# Altium schematic sheet Power.SchDoc
size A
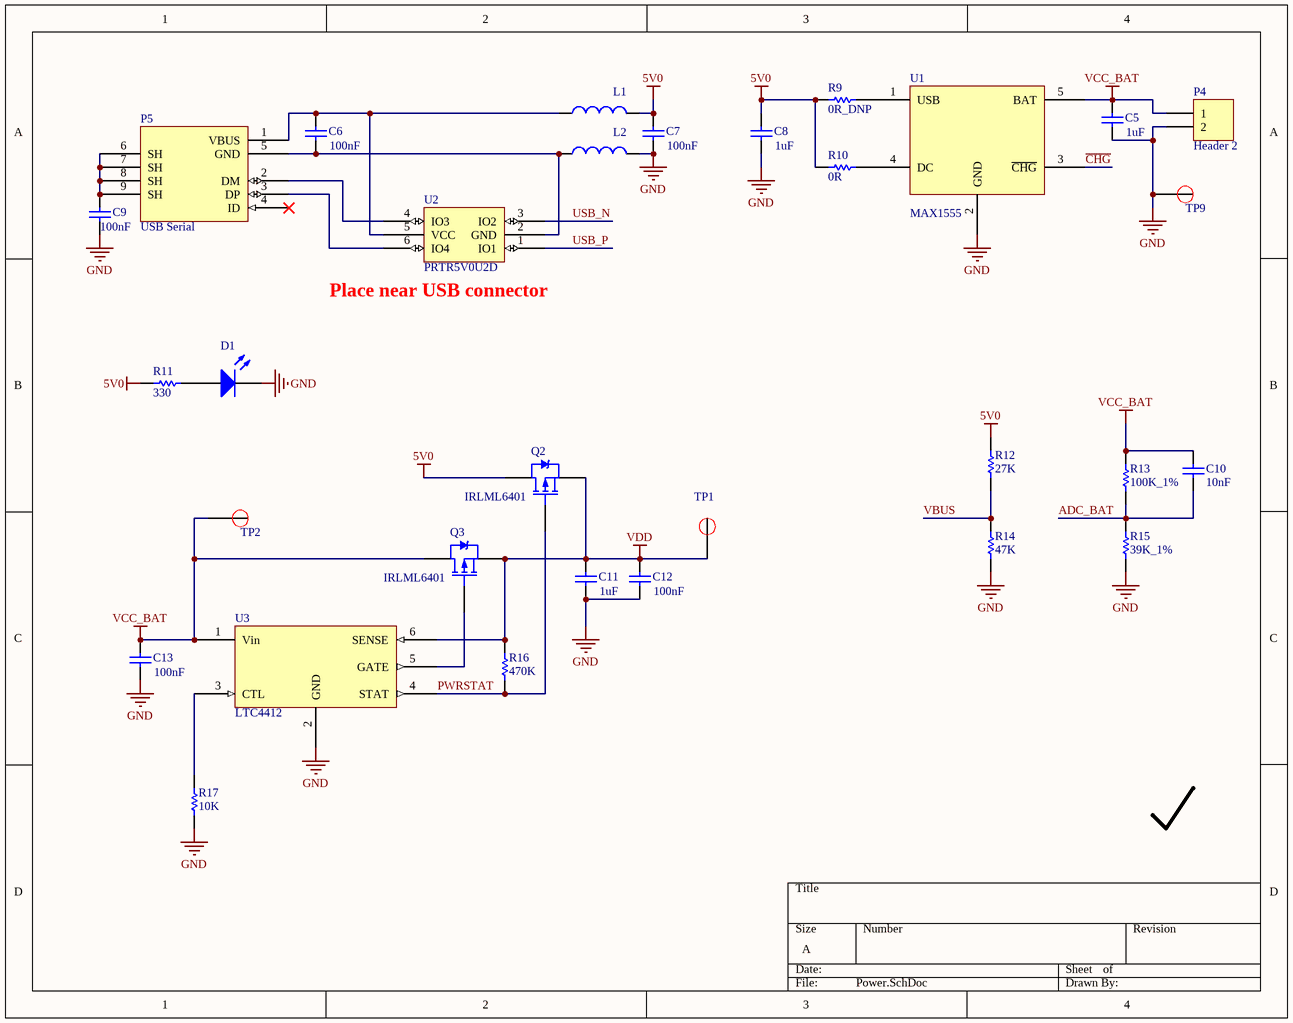
[diagram p0: Power.SchDoc]

## Parts
C5  value 1uF  [0603PKG]  (hidden comment: Cap)
C6  value 100nF  [C0805]  (hidden comment: Cap)
C7  value 100nF  [C0805]  (hidden comment: Cap)
C8  value 1uF  [0603PKG]  (hidden comment: Cap)
C9  value 100nF  [C0805]  (hidden comment: Cap)
C10  value 10nF  [0603PKG]  (hidden comment: Cap Semi)
C11  value 1uF  [0603PKG]  (hidden comment: Cap)
C12  value 100nF  [0603PKG]  (hidden comment: Cap)
C13  value 100nF  [0603PKG]  (hidden comment: Cap)
D1  LED0  [C0805]  (value not drawn)
L1  Ferrite Bead  [C0805]  (value not drawn)
L2  Ferrite Bead  [C0805]  (value not drawn)
P4  Header 2  [XH_2Pin_RA]
P5  USB Serial  [Mini USB]
Q2  IRLML6401  [SOT23]
Q3  IRLML6401  [SOT23]
R9  value 0R_DNP  [0603PKG]  (hidden comment: Res Semi)
R10  value 0R  [0603PKG]  (hidden comment: Res Semi)
R11  value 330  [0603PKG]  (hidden comment: Res Semi)
R12  value 27K  [0603PKG]  (hidden comment: Res Semi)
R13  value 100K_1%  [0603PKG]  (hidden comment: Res Semi)
R14  value 47K  [0603PKG]  (hidden comment: Res Semi)
R15  value 39K_1%  [0603PKG]  (hidden comment: Res Semi)
R16  value 470K  [0603PKG]  (hidden comment: Res Semi)
R17  value 10K  [0603PKG]  (hidden comment: Res Semi)
TP1  TP  [TP_15]  (value not drawn)
TP2  TP  [TP_15]  (value not drawn)
TP9  TP  [TP_15]  (value not drawn)
U1  MAX1555  [SOT23-5]
U2  PRTR5V0U2D  [SOT457]
U3  LTC4412  [SOT23-6]

## Nets
5V0: C7.2 C8.2 L1.2 Q2.3(D) R9.1 R10.1 R11.2 R12.2
GND: C5.1 C7.1 C8.1 C9.1 C11.1 C12.1 C13.1 D1.2(K) L2.2 P4.2 R14.1 R15.1 R17.1 TP9.1 U1.2(GND) U3.2(GND)
VCC_BAT: C5.2 C10.1 C13.2 P4.1 Q3.3(D) R13.2 TP2.1 U1.5(BAT) U3.1(Vin)
VDD: C11.2 C12.2 Q2.2(S) Q3.2(S) R16.2 TP1.1 U3.6(SENSE)
ADC_BAT: C10.2 R13.1 R15.2
~{CHG}: U1.3(~{CHG})
PWRSTAT: Q2.1(G) R16.1 U3.4(STAT)
USB_N: U2.3(IO2)
USB_P: U2.1(IO1)
VBUS: R12.1 R14.2
NetC6_1: C6.1 L2.1 P5.5(GND) U2.2(GND)
NetC6_2: C6.2 L1.1 P5.1(VBUS) U2.5(VCC)
NetC9_2: C9.2 P5.6(SH) P5.7(SH) P5.8(SH) P5.9(SH)
NetD1_1: D1.1(A) R11.1
NetP5_2: P5.2(DM) U2.4(IO3)
NetP5_3: P5.3(DP) U2.6(IO4)
NetQ3_1: Q3.1(G) U3.5(GATE)
NetR9_2: R9.2 U1.1(USB)
NetR10_2: R10.2 U1.4(DC)
NetR17_2: R17.2 U3.3(CTL)

Not connected (* = marked no-connect by the designer): P5 4(ID)*

## Notes on the sheet
- (near U2) Place near USB connector

## Library data of the parts
C5-C9 C11-C13 = Cap: Capacitor; Published: 8-Jun-2000; LatestRevisionDate: 17-Jul-2002; LatestRevisionNote: Re-released for DXP Platform.; PackageReference: RAD-0.3; Publisher: Altium Limited; PackageDescription: Radial Cap, Thru-Hole; 2 Leads; 0.3 in Pin Spacing
C10 = Cap Semi: Capacitor (Semiconductor SIM Model); Published: 8-Jun-2000; LatestRevisionDate: 29-May-2009; LatestRevisionNote: IPC-7351 Footprint Added.; PackageReference: C1206; Publisher: Altium Limited; PackageDescription: Chip Capacitor
D1 = LED0: Typical INFRARED GaAs LED; Published: 8-Jun-2000; LatestRevisionDate: 08-Jul-2005; LatestRevisionNote: Mech Layer 1 removed.; PackageReference: LED-0; Publisher: Altium Limited; PackageDescription: LED; 2 Leads
L1 L2 = Inductor: Code_IEC: 1005; Value: 10mH; Published: 8-Jun-2000; LatestRevisionDate: 29-May-2009; LatestRevisionNote: IPC-7351 Footprint Added.; PackageReference: 0402-A; Publisher: Altium Limited; PackageDescription: Chip Inductor; Code_JEITA: 0402
P4 = Header 2: Header, 2-Pin; LatestRevisionDate: 17-Jul-2002; LatestRevisionNote: Re-released for DXP Platform.; Publisher: Altium Limited
P5 = Mini USB
Q2 Q3 = PMOS-2: P-Channel Power MOSFET; Note: Pin 4 not drawn and electrically connected to Pin 2.; Published: 8-Jun-2000; LatestRevisionDate: 17-Jul-2002; LatestRevisionNote: Re-released for DXP Platform.; DatasheetVersion: PD-9.390D; PackageVersion: Feb-1997; PackageReference: TO-220AB; Publisher: Altium Limited; PackageDescription: TO, Thru-Hole, Vertical, Heatsink Mounted; 3 In-Line Leads; Pitch 2.54 mm; ComponentLink1Description: Manufacturer Link; ComponentLink1URL: http://www.irf.com/
R9-R17 = Res Semi: Semiconductor Resistor; Published: 8-Jun-2000; LatestRevisionDate: 17-Jul-2002; LatestRevisionNote: Re-released for DXP Platform.; PackageReference: AXIAL-0.5; Publisher: Altium Limited; PackageDescription: Axial Device, Thru-Hole; 2 Leads; 0.5 in Pin Spacing
TP1 TP2 TP9 = Test Point
U1 = MAX1555: 1-Cell Li+  Battery Chargers
U2 = PRTR5V0U2D: TVS Zener
U3 = LTC4412: Low Loss PowerPath™  Controller in ThinSOT